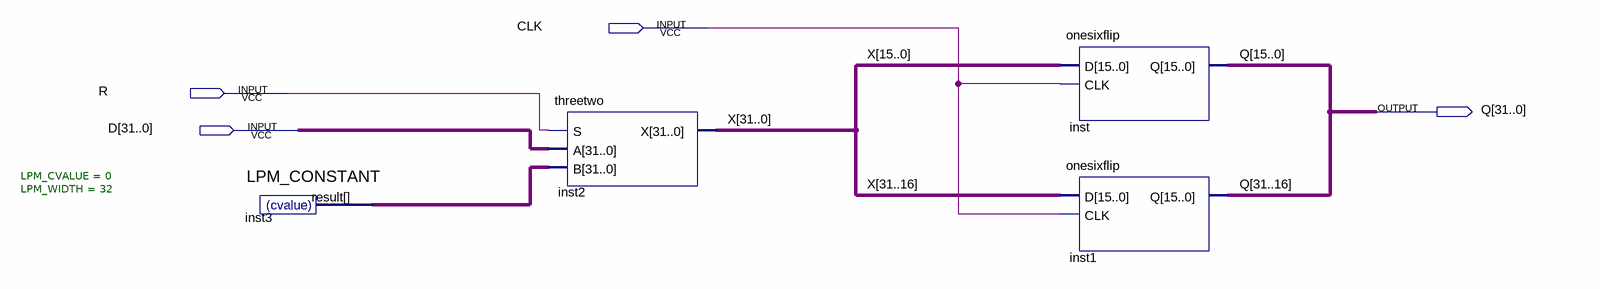
[diagram p0: schematic sheet]
// Quartus schematic threetwoflip.bdf as structural Verilog: 4 symbols, 4 pins
module threetwoflip (
  input  CLK,
  input  R,
  input  [31:0] D,
  output [31:0] Q
);

  wire [31:0] inst3_result, X;

  LPM_CONSTANT #(.LPM_CVALUE(0), .LPM_WIDTH(32)) inst3 (.result(inst3_result));
  threetwo inst2 (.S(R), .A(D), .B(inst3_result), .X(X));
  onesixflip inst (.D(X[15:0]), .CLK(CLK), .Q(Q[15:0]));
  onesixflip inst1 (.D(X[31:16]), .CLK(CLK), .Q(Q[31:16]));
endmodule
